# EAGLE schematic LPC2368 Breakout (EAGLE 6.2)
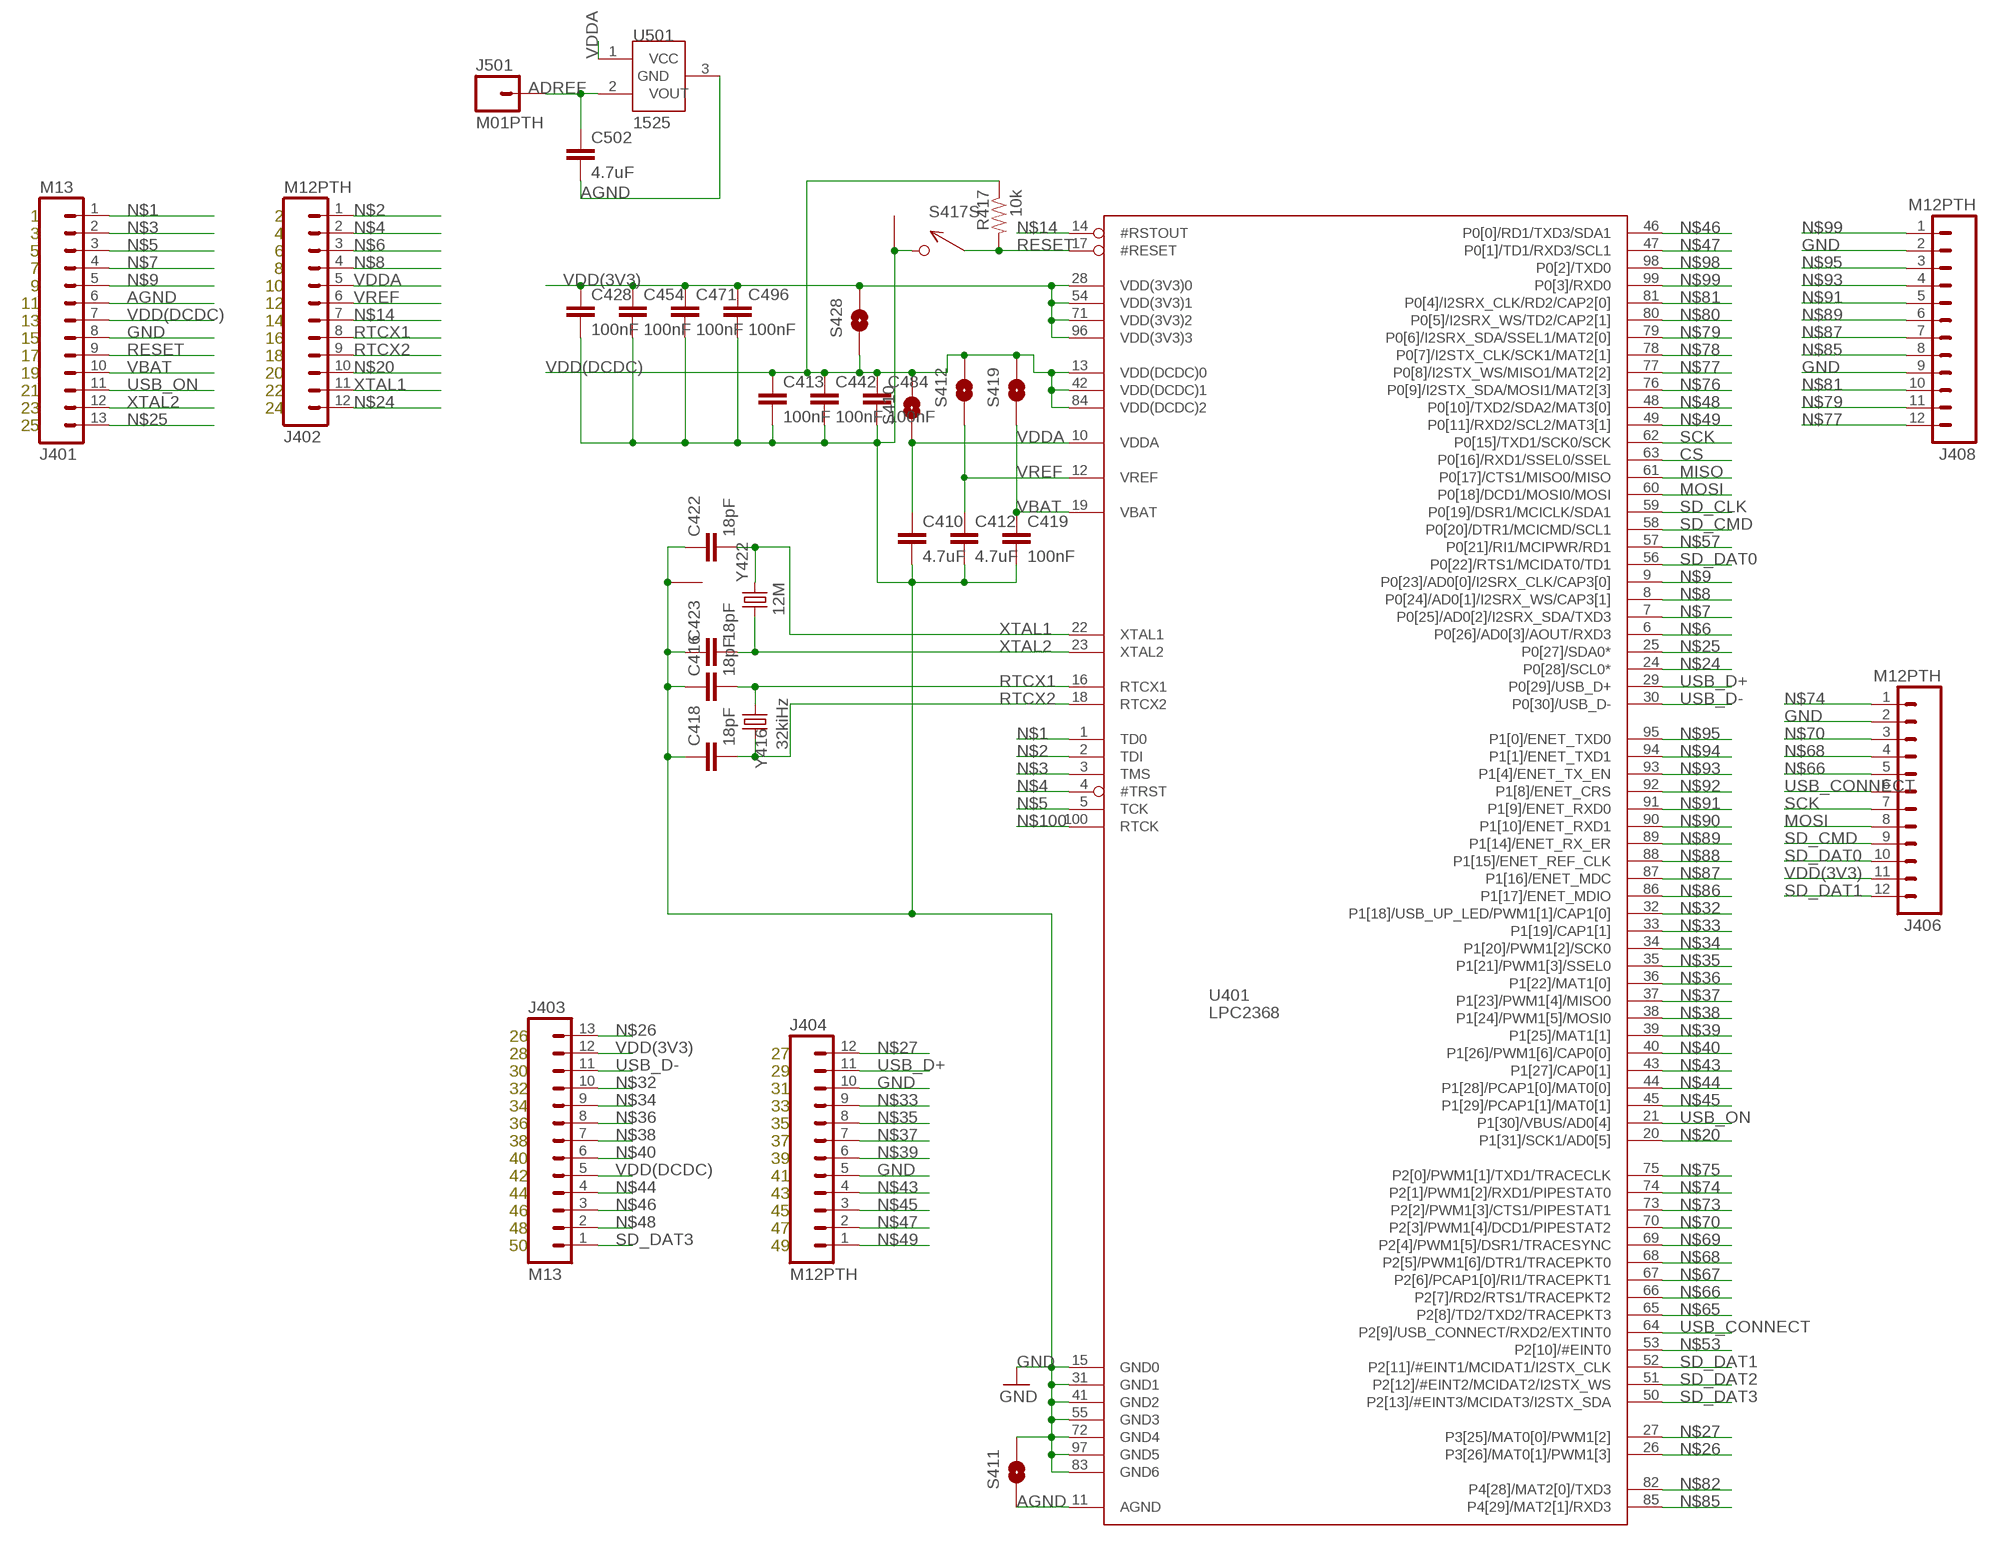
[diagram p0: schematic, sheet 1, part 1 of 2]
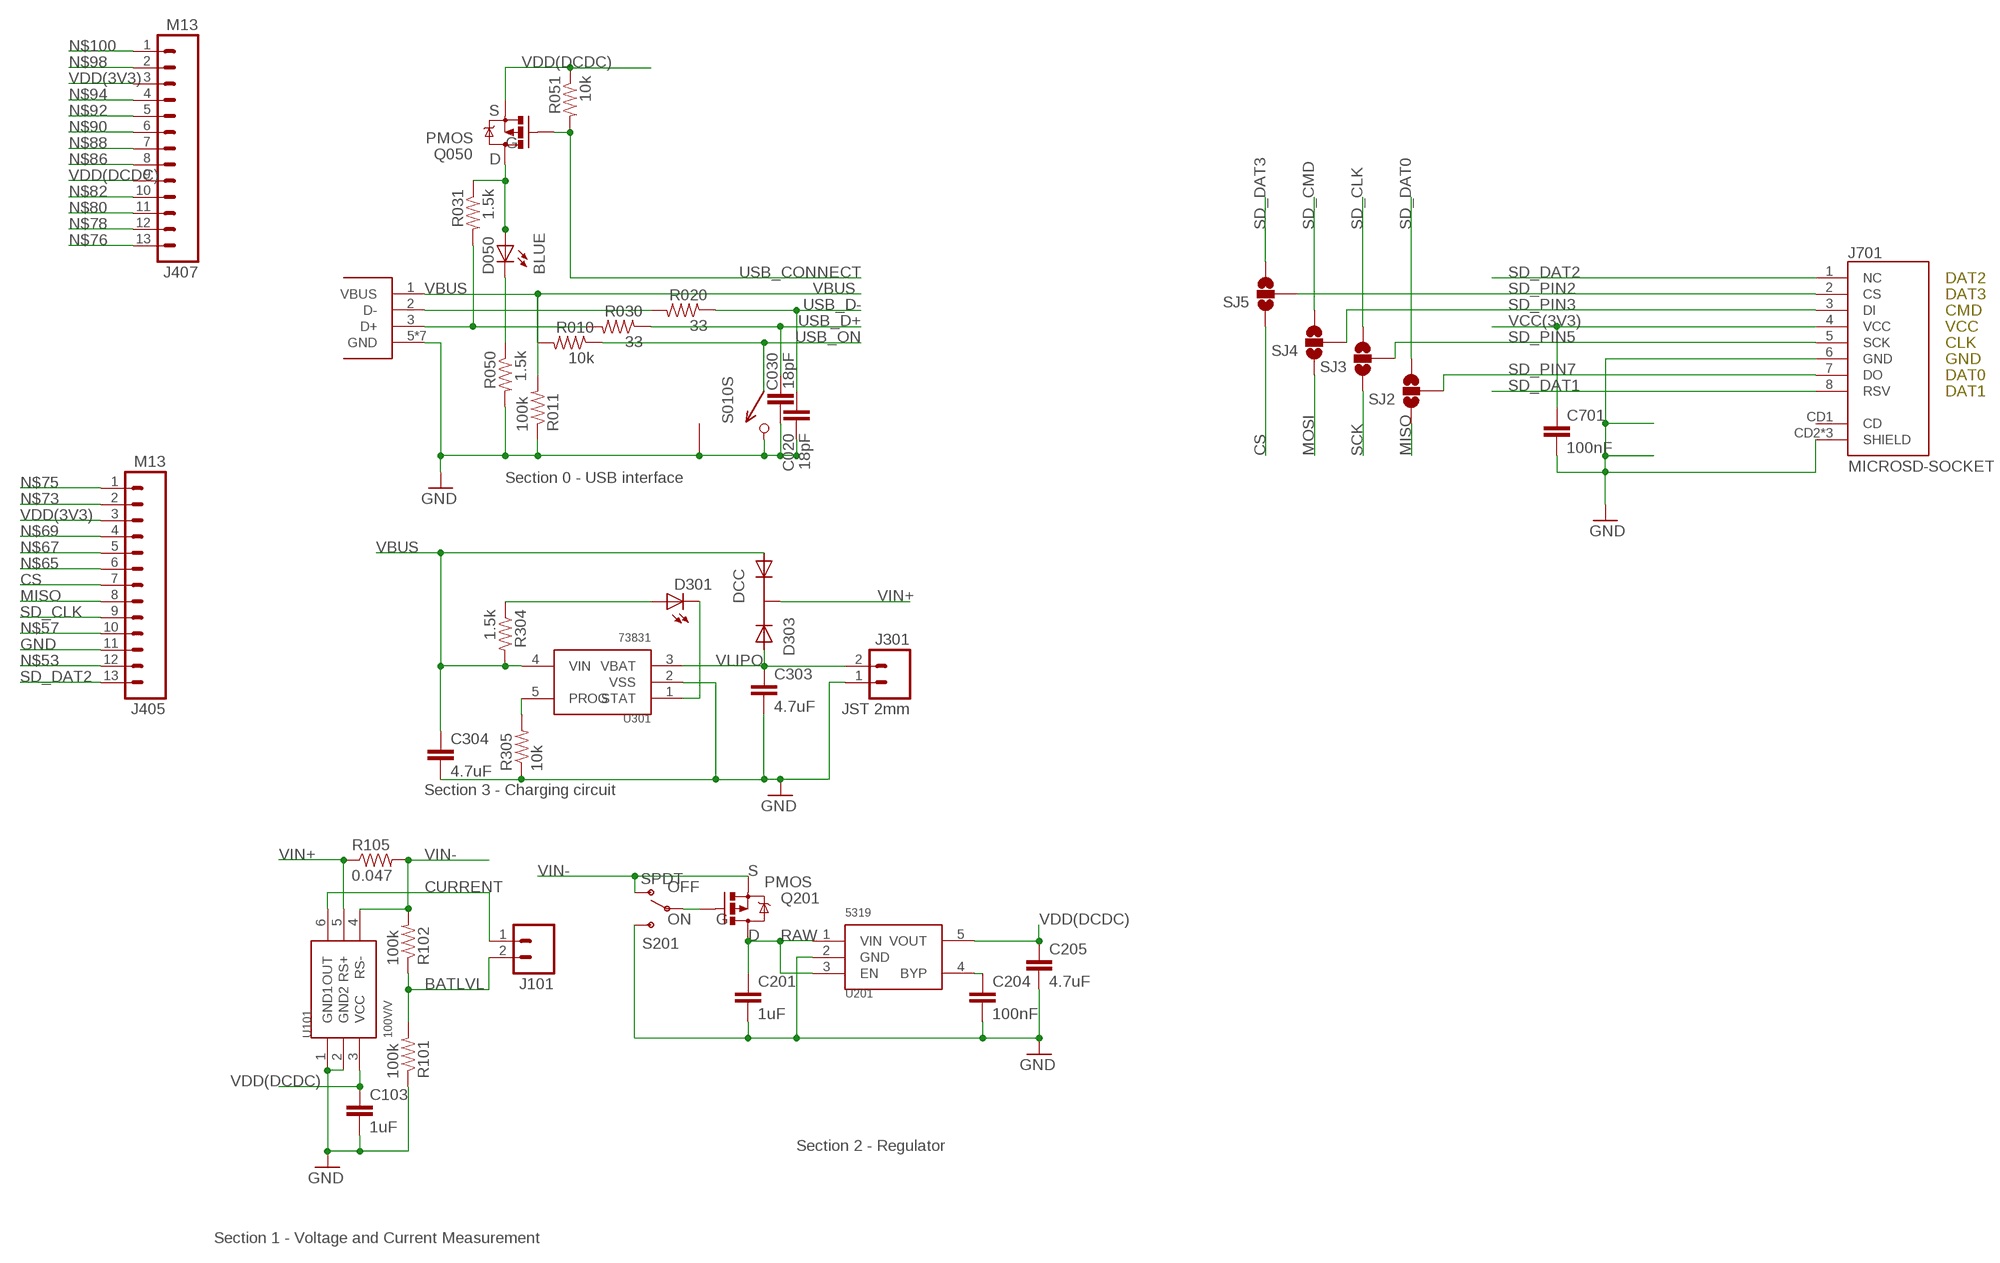
[diagram p1: schematic, sheet 1, part 2 of 2]

## Parts
C020  18pF  CAP0402-CAP  [0402-CAP]
C030  18pF  CAP0402-CAP  [0402-CAP]
C103  1uF  CAP0402-CAP  [0402-CAP]
C201  1uF  CAP0402-CAP  [0402-CAP]
C204  100nF  CAP0402-CAP  [0402-CAP]
C205  4.7uF  CAP0402-CAP  [0402-CAP]
C303  4.7uF  CAP0402-CAP  [0402-CAP]
C304  4.7uF  CAP0402-CAP  [0402-CAP]
C410  4.7uF  CAP0402-CAP  [0402-CAP]
C412  4.7uF  CAP0402-CAP  [0402-CAP]
C413  100nF  CAP0402-CAP  [0402-CAP]
C416  18pF  CAP0402-CAP  [0402-CAP]
C418  18pF  CAP0402-CAP  [0402-CAP]
C419  100nF  CAP0402-CAP  [0402-CAP]
C422  18pF  CAP0402-CAP  [0402-CAP]
C423  18pF  CAP0402-CAP  [0402-CAP]
C428  100nF  CAP0402-CAP  [0402-CAP]
C442  100nF  CAP0402-CAP  [0402-CAP]
C454  100nF  CAP0402-CAP  [0402-CAP]
C471  100nF  CAP0402-CAP  [0402-CAP]
C484  100nF  CAP0402-CAP  [0402-CAP]
C496  100nF  CAP0402-CAP  [0402-CAP]
C502  4.7uF  CAP0402-CAP  [0402-CAP]
C701  100nF  CAP0402-CAP  [0402-CAP]
D050  BLUE  LED0603  [LED-0603]
D301  YELLOW  LED0603  [LED-0603]
D303  DCC  PMEG2005CT  [SOT-23-3]
J001  USB_MICROB_JST  [UB-MC5BR3-SD204-4S]
J101  M02PTH  [1X02]
J301  JST 2mm  M02-JST-2MM-SMT  [JST-2-SMD]
J401  M13  [1X13]
J402  M12PTH  [1X12]
J403  M13  [1X13]
J404  M12PTH  [1X12]
J405  M13  [1X13]
J406  M12PTH  [1X12]
J407  M13  [1X13]
J408  M12PTH  [1X12]
J501  M01PTH  [1X01]
J701  MICROSD-SOCKET  [MICROSD-SOCKET-PP]
Q050  PMOS  MOSFET-PCHANNELSMD  [SOT23-3]
Q201  PMOS  MOSFET-PCHANNELSMD  [SOT23-3]
R010  10k  RESISTOR0402-RES  [0402-RES]
R011  100k  RESISTOR0402-RES  [0402-RES]
R020  33  RESISTOR0402-RES  [0402-RES]
R030  33  RESISTOR0402-RES  [0402-RES]
R031  1.5k  RESISTOR0402-RES  [0402-RES]
R050  1.5k  RESISTOR0402-RES  [0402-RES]
R051  10k  RESISTOR0402-RES  [0402-RES]
R101  100k  RESISTOR0402-RES  [0402-RES]
R102  100k  RESISTOR0402-RES  [0402-RES]
R105  0.047  RESISTOR0402-RES  [0402-RES]
R304  1.5k  RESISTOR0402-RES  [0402-RES]
R305  10k  RESISTOR0402-RES  [0402-RES]
R417  10k  RESISTOR0402-RES  [0402-RES]
S010  SPST  B3U-1100P  [B3U-1100P]
S201  SPDT  SWITCH-SPSTSMD  [AYZ0202]
S410  SOLDERJUMPERNO  [SJ_2S-NO]
S411  SOLDERJUMPERNO  [SJ_2S-NO]
S412  SOLDERJUMPERNO  [SJ_2S-NO]
S417  SPST  B3U-1100P  [B3U-1100P]
S419  SOLDERJUMPERNO  [SJ_2S-NO]
S428  SOLDERJUMPERNO  [SJ_2S-NO]
SJ2  SOLDERJUMPER_2WAYS  [SJ_3]
SJ3  SOLDERJUMPER_2WAYS  [SJ_3]
SJ4  SOLDERJUMPER_2WAYS  [SJ_3]
SJ5  SOLDERJUMPER_2WAYS  [SJ_3]
U101  100V/V  MAX4173  [SOT-23-6]
U201  5319  MIC5319D5  [SOT-23-5]
U301  73831  MCP73831  [SOT-23-5]
U401  LPC2368  [LQFP100]
U501  1525  MCP1525  [SOT-23-3]
Y416  32kiHz  CRYSTAL32-SMD  [CRYSTAL-32KHZ-SMD]
Y422  12M  TSX-3225  [CRYSTAL_SMD]

## Nets
ADREF: C502.1 J501.1 U501.2(VOUT)
AGND: C502.2 J401.6 S411.1 U401.11(AGND) U501.3(GND)
BATLVL: J101.2 R101.2 R102.1
C_STAT: D301.C U301.1(STAT)
CONN_D+: J001.3(D+) R030.2 R031.2
CONN_D-: J001.2(D-) R020.2
CS: J405.7 SJ5.1 U401.63(P0[16]/RXD1/SSEL0/SSEL)
CURRENT: J101.1 U101.6(OUT)
DR_STAT: D301.A R304.1
GND: C020.2 C030.2 C103.2 C201.2 C204.2 C205.2 C303.2 C304.2 C410.2 C412.2 C413.2 C416.1 C418.1 C419.2 C422.1 C423.1 C428.2 C442.2 C454.2 C471.2 C484.2 C496.2 C701.2 J001.5(GND) J001.P$6(GND) J001.P$7(GND) J001.P$8(GND) J001.P$9(GND) J001.P$10(GND) J001.P$11(GND) J301.1 J401.8 J404.5 J404.10 J405.11 J406.2 J408.2 J408.9 J701.6(GND) J701.CD2(SHIELD) J701.GND1(SHIELD) J701.GND3(SHIELD) R011.1 R050.2 R101.1 R305.1 S010.P$2 S010.P$3 S201.3(S) S411.2 S417.P$2 S417.P$3 U101.1(GND1) U101.2(GND2) U201.2(GND) U301.2(VSS) U401.15(GND0) U401.31(GND1) U401.41(GND2) U401.55(GND3) U401.72(GND4) U401.83(GND6) U401.97(GND5) Y422.2 Y422.4
MISO: J405.8 SJ2.1 U401.61(P0[17]/CTS1/MISO0/MISO)
MOSI: J406.8 SJ4.1 U401.60(P0[18]/DCD1/MOSI0/MOSI)
N$1: J401.1 U401.1(TD0)
N$2: J402.1 U401.2(TDI)
N$3: J401.2 U401.3(TMS)
N$4: J402.2 U401.4(#TRST)
N$5: J401.3 U401.5(TCK)
N$6: J402.3 U401.6(P0[26]/AD0[3]/AOUT/RXD3)
N$7: J401.4 U401.7(P0[25]/AD0[2]/I2SRX_SDA/TXD3)
N$8: J402.4 U401.8(P0[24]/AD0[1]/I2SRX_WS/CAP3[1])
N$9: J401.5 U401.9(P0[23]/AD0[0]/I2SRX_CLK/CAP3[0])
N$13: R305.2 U301.5(PROG)
N$14: J402.7 U401.14(#RSTOUT)
N$15: C204.1 U201.4(BYP)
N$16: D050.C R050.1
N$18: Q201.1(G) S201.2(P)
N$20: J402.10 U401.20(P1[31]/SCK1/AD0[5])
N$24: J402.12 U401.24(P0[28]/SCL0*)
N$25: J401.13 U401.25(P0[27]/SDA0*)
N$26: J403.13 U401.26(P3[26]/MAT0[1]/PWM1[3])
N$27: J404.12 U401.27(P3[25]/MAT0[0]/PWM1[2])
N$28: D050.A Q050.3(D) R031.1
N$32: J403.10 U401.32(P1[18]/USB_UP_LED/PWM1[1]/CAP1[0])
N$33: J404.9 U401.33(P1[19]/CAP1[1])
N$34: J403.9 U401.34(P1[20]/PWM1[2]/SCK0)
N$35: J404.8 U401.35(P1[21]/PWM1[3]/SSEL0)
N$36: J403.8 U401.36(P1[22]/MAT1[0])
N$37: J404.7 U401.37(P1[23]/PWM1[4]/MISO0)
N$38: J403.7 U401.38(P1[24]/PWM1[5]/MOSI0)
N$39: J404.6 U401.39(P1[25]/MAT1[1])
N$40: J403.6 U401.40(P1[26]/PWM1[6]/CAP0[0])
N$43: J404.4 U401.43(P1[27]/CAP0[1])
N$44: J403.4 U401.44(P1[28]/PCAP1[0]/MAT0[0])
N$45: J404.3 U401.45(P1[29]/PCAP1[1]/MAT0[1])
N$46: J403.3 U401.46(P0[0]/RD1/TXD3/SDA1)
N$47: J404.2 U401.47(P0[1]/TD1/RXD3/SCL1)
N$48: J403.2 U401.48(P0[10]/TXD2/SDA2/MAT3[0])
N$49: J404.1 U401.49(P0[11]/RXD2/SCL2/MAT3[1])
N$53: J405.12 U401.53(P2[10]/#EINT0)
N$57: J405.10 U401.57(P0[21]/RI1/MCIPWR/RD1)
N$65: J405.6 U401.65(P2[8]/TD2/TXD2/TRACEPKT3)
N$66: J406.5 U401.66(P2[7]/RD2/RTS1/TRACEPKT2)
N$67: J405.5 U401.67(P2[6]/PCAP1[0]/RI1/TRACEPKT1)
N$68: J406.4 U401.68(P2[5]/PWM1[6]/DTR1/TRACEPKT0)
N$69: J405.4 U401.69(P2[4]/PWM1[5]/DSR1/TRACESYNC)
N$70: J406.3 U401.70(P2[3]/PWM1[4]/DCD1/PIPESTAT2)
N$73: J405.2 U401.73(P2[2]/PWM1[3]/CTS1/PIPESTAT1)
N$74: J406.1 U401.74(P2[1]/PWM1[2]/RXD1/PIPESTAT0)
N$75: J405.1 U401.75(P2[0]/PWM1[1]/TXD1/TRACECLK)
N$76: J407.13 U401.76(P0[9]/I2STX_SDA/MOSI1/MAT2[3])
N$77: J408.12 U401.77(P0[8]/I2STX_WS/MISO1/MAT2[2])
N$78: J407.12 U401.78(P0[7]/I2STX_CLK/SCK1/MAT2[1])
N$79: J408.11 U401.79(P0[6]/I2SRX_SDA/SSEL1/MAT2[0])
N$80: J407.11 U401.80(P0[5]/I2SRX_WS/TD2/CAP2[1])
N$81: J408.10 U401.81(P0[4]/I2SRX_CLK/RD2/CAP2[0])
N$82: J407.10 U401.82(P4[28]/MAT2[0]/TXD3)
N$85: J408.8 U401.85(P4[29]/MAT2[1]/RXD3)
N$86: J407.8 U401.86(P1[17]/ENET_MDIO)
N$87: J408.7 U401.87(P1[16]/ENET_MDC)
N$88: J407.7 U401.88(P1[15]/ENET_REF_CLK)
N$89: J408.6 U401.89(P1[14]/ENET_RX_ER)
N$90: J407.6 U401.90(P1[10]/ENET_RXD1)
N$91: J408.5 U401.91(P1[9]/ENET_RXD0)
N$92: J407.5 U401.92(P1[8]/ENET_CRS)
N$93: J408.4 U401.93(P1[4]/ENET_TX_EN)
N$94: J407.4 U401.94(P1[1]/ENET_TXD1)
N$95: J408.3 U401.95(P1[0]/ENET_TXD0)
N$98: J407.2 U401.98(P0[2]/TXD0)
N$99: J408.1 U401.99(P0[3]/RXD0)
N$100: J407.1 U401.100(RTCK)
RAW: C201.1 Q201.3(D) U201.1(VIN) U201.3(EN)
RESET: J401.9 R417.2 S417.P$1 U401.17(#RESET)
RTCX1: C416.2 J402.8 U401.16(RTCX1) Y416.X1
RTCX2: C418.2 J402.9 U401.18(RTCX2) Y416.X2
SCK: J406.7 SJ3.1 U401.62(P0[15]/TXD1/SCK0/SCK)
SD_CLK: J405.9 SJ3.3 U401.59(P0[19]/DSR1/MCICLK/SDA1)
SD_CMD: J406.9 SJ4.3 U401.58(P0[20]/DTR1/MCICMD/SCL1)
SD_DAT0: J406.10 SJ2.3 U401.56(P0[22]/RTS1/MCIDAT0/TD1)
SD_DAT1: J406.12 J701.8(RSV) U401.52(P2[11]/#EINT1/MCIDAT1/I2STX_CLK)
SD_DAT2: J405.13 J701.1(NC) U401.51(P2[12]/#EINT2/MCIDAT2/I2STX_WS)
SD_DAT3: J403.1 SJ5.3 U401.50(P2[13]/#EINT3/MCIDAT3/I2STX_SDA)
SD_PIN2: J701.2(CS) SJ5.2
SD_PIN3: J701.3(DI) SJ4.2
SD_PIN5: J701.5(SCK) SJ3.2
SD_PIN7: J701.7(DO) SJ2.2
USB_CONNECT: J406.6 Q050.1(G) R051.2 U401.64(P2[9]/USB_CONNECT/RXD2/EXTINT0)
USB_D+: C030.1 J404.11 R030.1 U401.29(P0[29]/USB_D+)
USB_D-: C020.1 J403.11 R020.1 U401.30(P0[30]/USB_D-)
USB_ON: J401.11 R010.1 S010.P$1 U401.21(P1[30]/VBUS/AD0[4])
VBAT: C419.1 J401.10 S419.1 U401.19(VBAT)
VBUS [power]: C304.1 D303.1(A1) J001.1(VBUS) R010.2 R011.2 R304.2 U301.4(VIN)
VCC(3V3): C701.1 J701.4(VCC)
VDD(3V3): C428.1 C454.1 C471.1 C496.1 J403.12 J405.3 J406.11 J407.3 S428.2 U401.28(VDD(3V3)0) U401.54(VDD(3V3)1) U401.71(VDD(3V3)2) U401.96(VDD(3V3)3)
VDD(DCDC): C103.1 C205.1 C413.1 C442.1 C484.1 J401.7 J403.5 J407.9 Q050.2(S) R051.1 R417.1 S410.2 S412.2 S419.2 S428.1 U101.3(VCC) U201.5(VOUT) U401.13(VDD(DCDC)0) U401.42(VDD(DCDC)1) U401.84(VDD(DCDC)2)
VDDA: C410.1 J402.5 S410.1 U401.10(VDDA) U501.1(VCC)
VIN+: D303.3(K) R105.1 U101.5(RS+)
VIN-: Q201.2(S) R102.2 R105.2 S201.1(O) U101.4(RS-)
VLIPO [power]: C303.1 D303.2(A2) J301.2 U301.3(VBAT)
VREF: C412.1 J402.6 S412.1 U401.12(VREF)
XTAL1: C422.2 J402.11 U401.22(XTAL1) Y422.3
XTAL2: C423.2 J401.12 U401.23(XTAL2) Y422.1
Unconnected: J701.CD1(CD)

## Notes on the sheet
- 1 | 2
- 3 | 4
- 5 | 6
- 7 | 8
- 9 | 10
- 11 | 12 | S
- 13 | 14
- 15 | 16 | G
- 17 | 18 | D
- 19 | 20
- 21 | 22
- 23 | 24
- 25
- DAT2
- DAT3
- CMD
- VCC
- CLK
- GND
- DAT0
- DAT1
- Section 0 - USB interface
- 26 | Section 3 - Charging circuit
- 28 | 27
- 30 | 29
- 32 | 31
- 34 | 33
- 36 | 35 | S
- 38 | 37 | OFF
- 40 | 39
- 42 | 41 | ON | G
- 44 | 43 | D
- 46 | 45
- 48 | 47
- 50 | 49
- Section 2 - Regulator
- Section 1 - Voltage and Current Measurement

## Library data of the parts
C020 C030 = SparkFun:CAP: Capacitor Standard 0603 ceramic capacitor, and 0.1" leaded capacitor.; DIGIKEY: 445-1238-1-ND
C103 C201 = SparkFun:CAP: Capacitor Standard 0603 ceramic capacitor, and 0.1" leaded capacitor.; DIGIKEY: 445-1415-1-ND
C204 C701 = SparkFun:CAP: Capacitor Standard 0603 ceramic capacitor, and 0.1" leaded capacitor.; DIGIKEY: 445-1268-1-ND
C205 C303 C304 C502 = SparkFun:CAP: Capacitor Standard 0603 ceramic capacitor, and 0.1" leaded capacitor.; DIGIKEY: 445-7395-1-ND
C410 C412 = SparkFun-Passives:CAP: Capacitor Standard 0603 ceramic capacitor, and 0.1" leaded capacitor.; DIGIKEY: 445-7395-1-ND
C413 C419 C428 C442 C454 C471 C484 C496 = SparkFun-Passives:CAP: Capacitor Standard 0603 ceramic capacitor, and 0.1" leaded capacitor.; DIGIKEY: 445-1268-1-ND
C416 C418 C422 C423 = SparkFun-Passives:CAP: Capacitor Standard 0603 ceramic capacitor, and 0.1" leaded capacitor.; DIGIKEY: 445-1238-1-ND
D050 = SparkFun:LED: LEDs Standard schematic elements and footprints for 5mm, 3mm, 1206, and 0603 sized LEDs. 5mm - Spark Fun Electronics SKU : COM-00529 (and others); DIGIKEY: 754-1434-1-ND
D301 = SparkFun:LED: LEDs Standard schematic elements and footprints for 5mm, 3mm, 1206, and 0603 sized LEDs. 5mm - Spark Fun Electronics SKU : COM-00529 (and others); DIGIKEY: 754-1354-1-ND
D303 = KwanSystems:PMEG2005CT; DIGIKEY: 568-6500-1-ND
J001 = KwanSystems:USB_MICROB_JST; DIGIKEY: 455-2562-1-ND
J101 = SparkFun-Connectors:M02: Header 2 Standard 2-pin 0.1" header. Use with straight break away headers (SKU : PRT-00116), right angle break away headers (PRT-00553), swiss pins (PRT-00743), machine pins (PRT-00117), and female headers (PRT-00115). Molex polarized connector foot print use with SKU : PRT-08233 with associated crimp pins and housings.; DIGIKEY: $NOPART
J301 = SparkFun:M02: Header 2 Standard 2-pin 0.1" header. Use with straight break away headers (SKU : PRT-00116), right angle break away headers (PRT-00553), swiss pins (PRT-00743), machine pins (PRT-00117), and female headers (PRT-00115). Molex polarized connector foot print use with SKU : PRT-08233 with associated crimp pins and housings.; DIGIKEY: 455-1749-1-ND
J401 J403 J405 J407 = SparkFun-Connectors:M13: 13-pin single row .1" header; DIGIKEY: $NOPART
J402 J404 J406 J408 = SparkFun-Connectors:M12: Header 12 Standard 12-pin 0.1" header. Use with straight break away headers (SKU : PRT-00116), right angle break away headers (PRT-00553), swiss pins (PRT-00743), machine pins (PRT-00117), and female headers (PRT-00115).; DIGIKEY: $NOPART
J501 = SparkFun-Connectors:M01: Header 1 Standard 1-pin 0.1" header. Use with straight break away headers (SKU : PRT-00116), right angle break away headers (PRT-00553), swiss pins (PRT-00743), machine pins (PRT-00117), and female headers (PRT-00115).; DIGIKEY: $NOPART
J701 = KwanSystems:MICROSD-SOCKET: microSD Socket Push-push type uSD socket. Digikey 101-00660-68-6-1-ND. tDoc lines correctly indicate media card edge positions when inserting (unlocked, locked, depressed).; DIGIKEY: 101-00581-59-1-ND
Q050 Q201 = SparkFun:MOSFET-PCHANNEL; DIGIKEY: NTR1P02T1GOSCT-ND
R010 R051 R305 R417 = SparkFun:RESISTOR: Resistor Basic schematic elements and footprints for 0603, 1206, and PTH resistors.; DIGIKEY: P10.0KLCT-ND
R011 R101 R102 = SparkFun:RESISTOR: Resistor Basic schematic elements and footprints for 0603, 1206, and PTH resistors.; DIGIKEY: P100KLCT-ND
R020 R030 = SparkFun:RESISTOR: Resistor Basic schematic elements and footprints for 0603, 1206, and PTH resistors.; DIGIKEY: P33.0LCT-ND
R031 R050 R304 = SparkFun:RESISTOR: Resistor Basic schematic elements and footprints for 0603, 1206, and PTH resistors.; DIGIKEY: P1.50KLCT-ND
R105 = SparkFun:RESISTOR: Resistor Basic schematic elements and footprints for 0603, 1206, and PTH resistors.; DIGIKEY: P.047ATCT-ND
S010 S417 = KwanSystems:B3U-1100P; DIGIKEY: SW1021CT-ND
S201 = SparkFun:SWITCH-SPST: SPST Switch Simple slide switch. Spark Fun Electronics SKU : COM-00102; DIGIKEY: 401-2013-1-ND
S410-S412 S419 S428 = SparkFun-Passives:SOLDERJUMPER: Solder Jumper Standard SMD solder jumper. Used to automate production. Two varients : Normally Open and Normally Closed are the same, but have different paste layers. NC will have a large amount of paste and should jumper during reflow.; DIGIKEY: $NOPART
SJ2-SJ5 = SparkFun-Passives:SOLDERJUMPER_2WAY: Solder Jumper 2 way solder jumper; DIGIKEY: $NOPART
U101 = KwanSystems:MAX4173; DIGIKEY: MAX4173HEUT+TCT-ND
U201 = KwanSystems:MIC5319; DIGIKEY: 576-1910-1-ND
U301 = KwanSystems:MCP73831; DIGIKEY: MCP73831T-2ACI/OTCT-ND
U401 = KwanSystems:LPC2368; DIGIKEY: 568-3997-ND
U501 = KwanSystems:MCP1525; DIGIKEY: MCP1525T-I/TTCT-ND
Y416 = SparkFun:CRYSTAL: Crystals Various standard crystals. Proven footprints. Spark Fun Electronics SKU : COM-00534; DIGIKEY: $NOPART
Y422 = KwanSystems:TSX-3225; DIGIKEY: 887-1316-1-ND

## Net classes
0 default: width 0.152 mm, drill 0.33 mm, clearance 0.152 mm
1 power: width 0.152 mm, drill 0.33 mm, clearance 0.152 mm to class 0, clearance 0.152 mm